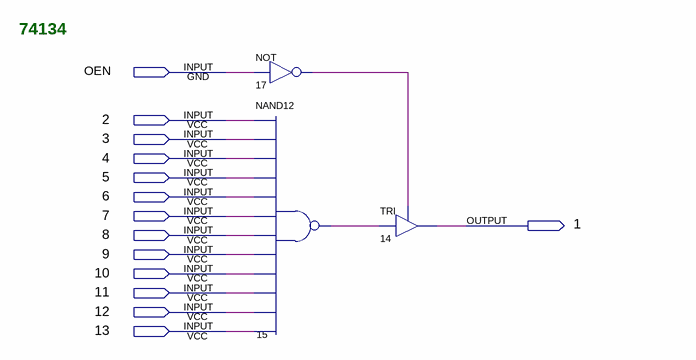
[diagram p0: schematic sheet]
// Quartus schematic 74134.bdf as structural Verilog: 3 symbols, 14 pins
module \74134  (
  input  OEN,
  input  \2 ,
  input  \3 ,
  input  \4 ,
  input  \5 ,
  input  \6 ,
  input  \7 ,
  input  \8 ,
  input  \9 ,
  input  \10 ,
  input  \11 ,
  input  \12 ,
  input  \13 ,
  output \1 
);

  wire n15_out, n17_out;

  not u_17 (n17_out, OEN);
  nand u_15 (n15_out, \2 , \3 , \4 , \5 , \6 , \7 , \8 , \9 , \10 , \11 , \12 , \13 );
  TRI u_14 (.IN(n15_out), .OE(n17_out), .OUT(\1 ));

  // Notes on the sheet:
  //   74134
endmodule
